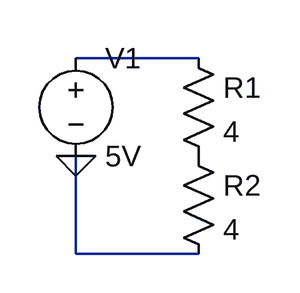
[diagram p0: schematic code.asc]
code.asc, the LTspice schematic file:
Version 4
SHEET 1 880 680
SYMBOL voltage 200 84 R0
SYMATTR InstName V1
SYMATTR Value 5V
SYMBOL res 284 84 R0
SYMATTR InstName R1
SYMATTR Value 4
SYMBOL res 284 164 R0
SYMATTR InstName R2
SYMATTR Value 4
WIRE 200 100 300 100
WIRE 300 260 200 260
WIRE 200 260 200 180
FLAG 200 180 0

The netlist it stands for:
* code.asc
V1 N001 0 5V
R1 N001 P001 4
R2 P001 0 4
.backanno
.end